# EAGLE design 454_stereo_mic_Rev020000 (EAGLE 9.6.2)
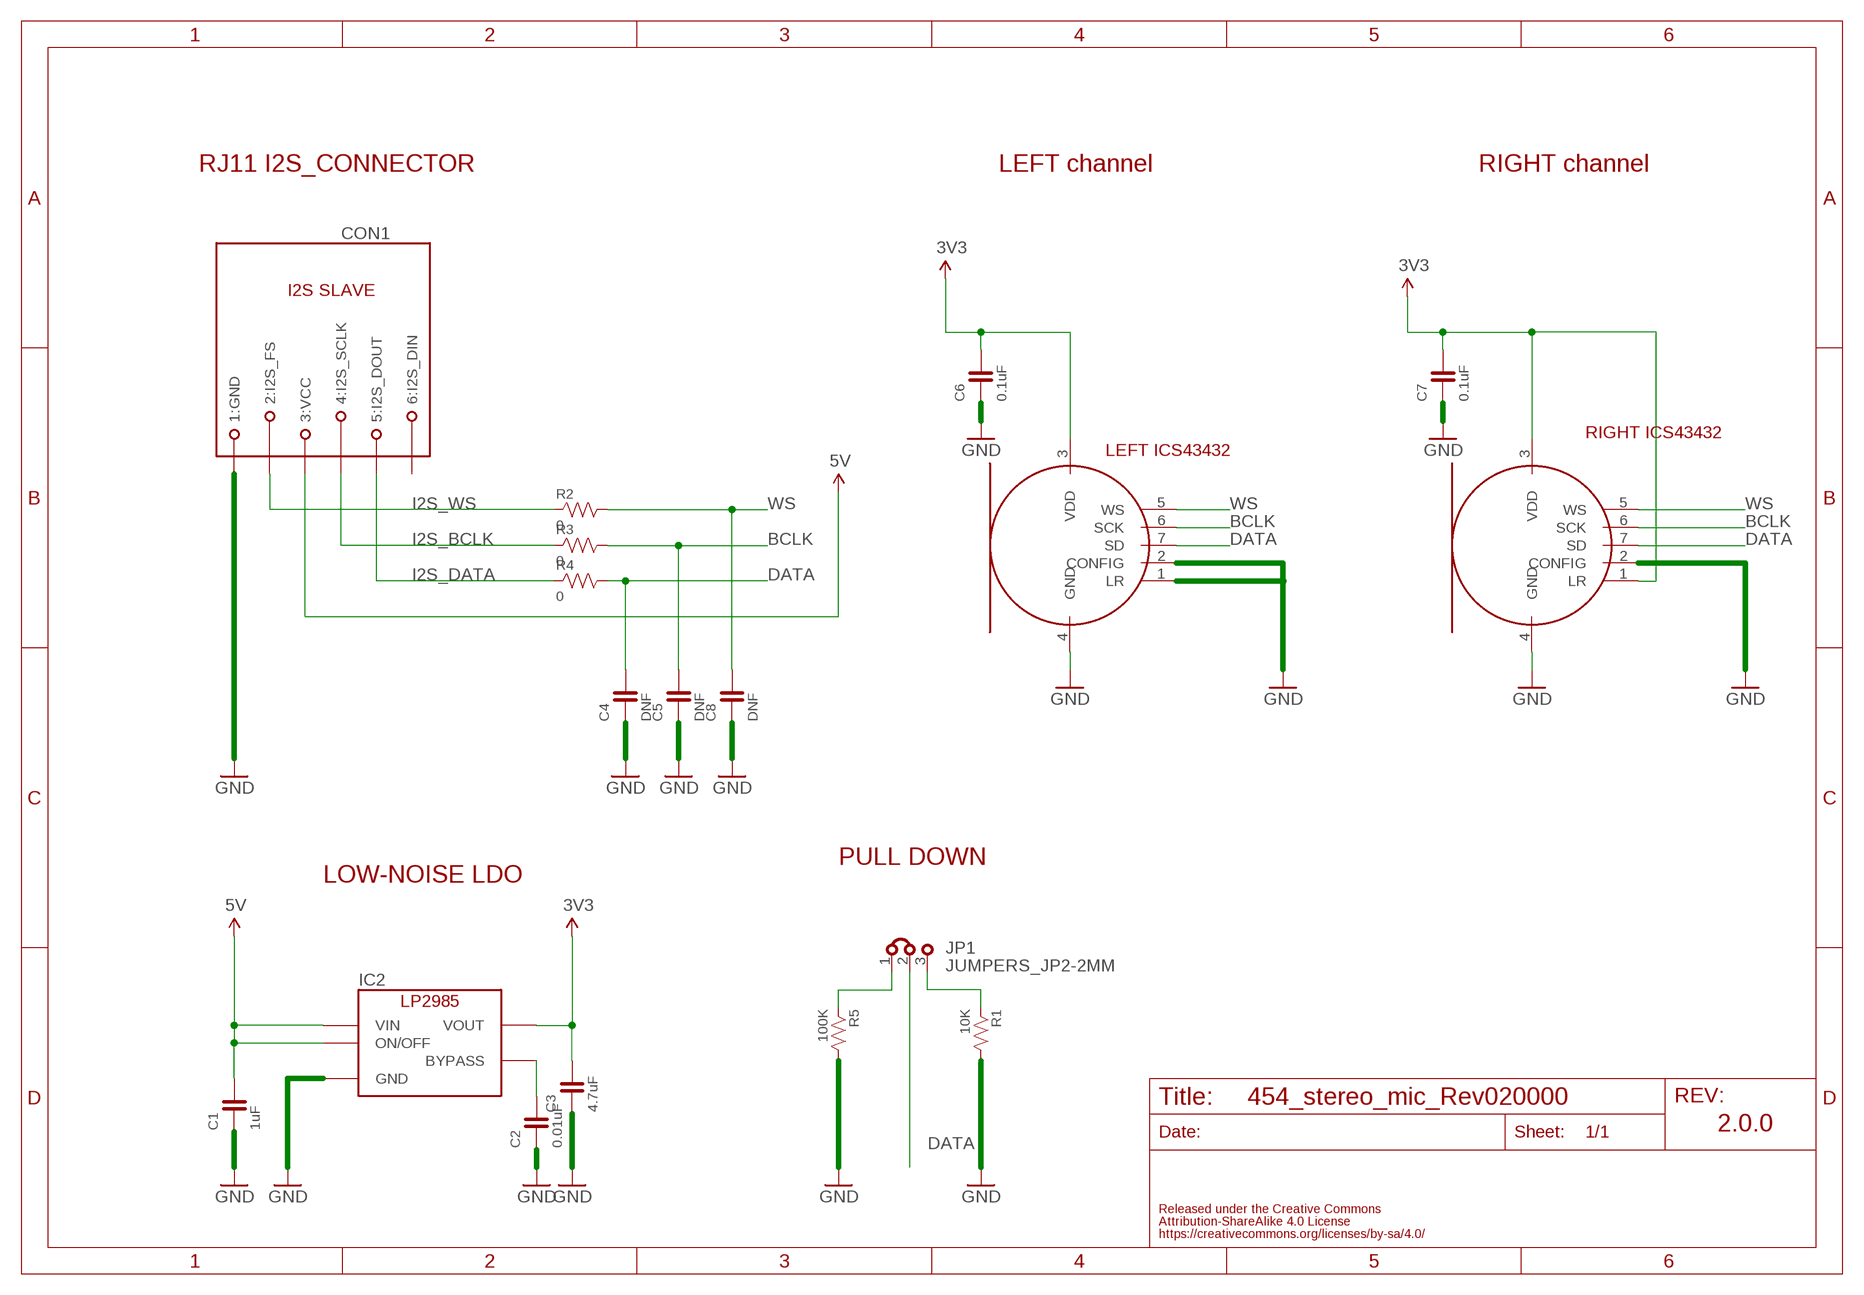
[diagram p0: schematic, sheet 1]

## Parts
C1  1uF  CAPACITOR-0603  [0603]
C2  0.01uF  CAPACITOR-0603  [0603]
C3  4.7uF  CAPACITOR-0603  [0603]
C4  DNF  CAPACITOR-0603  [0603]
C5  DNF  CAPACITOR-0603  [0603]
C6  0.1uF  CAPACITOR-0603  [0603]
C7  0.1uF  CAPACITOR-0603  [0603]
C8  DNF  CAPACITOR-0603  [0603]
CON1  MODULAR-JACK-6P-RJ11_I2S_SLAVE  [7002-6PXC-X]
IC2  LP2985-33DBV  [SOT-23-5]
JP1  JUMPERS_JP2-2MM  [JUMPERS_JP2-2MM]
MIC_LEFT  TDK-ICS43432  [TDK-ICS43432]
MIC_RIGHT  TDK-ICS43432  [TDK-ICS43432]
R1  10K  RESISTOR-0603  [0603]
R2  0  RESISTOR-0603  [0603]
R3  0  RESISTOR-0603  [0603]
R4  0  RESISTOR-0603  [0603]
R5  100K  RESISTOR-0603  [0603]

## Nets
3V3: C3.2 C6.2 C7.2 IC2.5(VOUT) MIC_LEFT.3(VDD) MIC_RIGHT.1(LR) MIC_RIGHT.3(VDD)
5V: C1.2 CON1.3(3:VCC) IC2.1(VIN) IC2.3(ON/OFF)
BCLK: C5.2 MIC_LEFT.6(SCK) MIC_RIGHT.6(SCK) R3.2
DATA: C4.2 JP1.2 MIC_LEFT.7(SD) MIC_RIGHT.7(SD) R4.2
GND: C1.1 C2.1 C3.1 C4.1 C5.1 C6.1 C7.1 C8.1 CON1.1(1:GND) IC2.2(GND) MIC_LEFT.1(LR) MIC_LEFT.2(CONFIG) MIC_LEFT.4(GND) MIC_RIGHT.2(CONFIG) MIC_RIGHT.4(GND) R1.2 R5.2
I2S_BCLK: CON1.4(4:I2S_SCLK) R3.1
I2S_DATA: CON1.5(5:I2S_DOUT) R4.1
I2S_WS: CON1.2(2:I2S_FS) R2.1
N$1: C2.2 IC2.4(BYPASS)
N$2: JP1.1 R5.1
N$3: JP1.3 R1.1
WS: C8.2 MIC_LEFT.5(WS) MIC_RIGHT.5(WS) R2.2
Unconnected: CON1.6(6:I2S_DIN)

## Notes on the sheet
- RJ11 I2S_CONNECTOR | LEFT channel | RIGHT channel
- RIGHT ICS43432
- LEFT ICS43432
- PULL DOWN
- LOW-NOISE LDO
- 2.0.0

## Library data of the parts
C1-C8 = FaBo-Capacitor:CAPACITOR: CAPACITOR
CON1 = FaBo-Connetor:MODULAR-JACK-6P-RJ11_I2S_SLAVE
IC2 = FaBo-Supply:LP2985: LP2985
JP1 = 52101-101-REV-A_v16:JUMPERS_JP2-: Jumper/Bridge
MIC_LEFT MIC_RIGHT = FaBo-Mems:TDK-ICS43432
R1-R5 = FaBo-Resistors:RESISTOR: RESISTOR

## Board
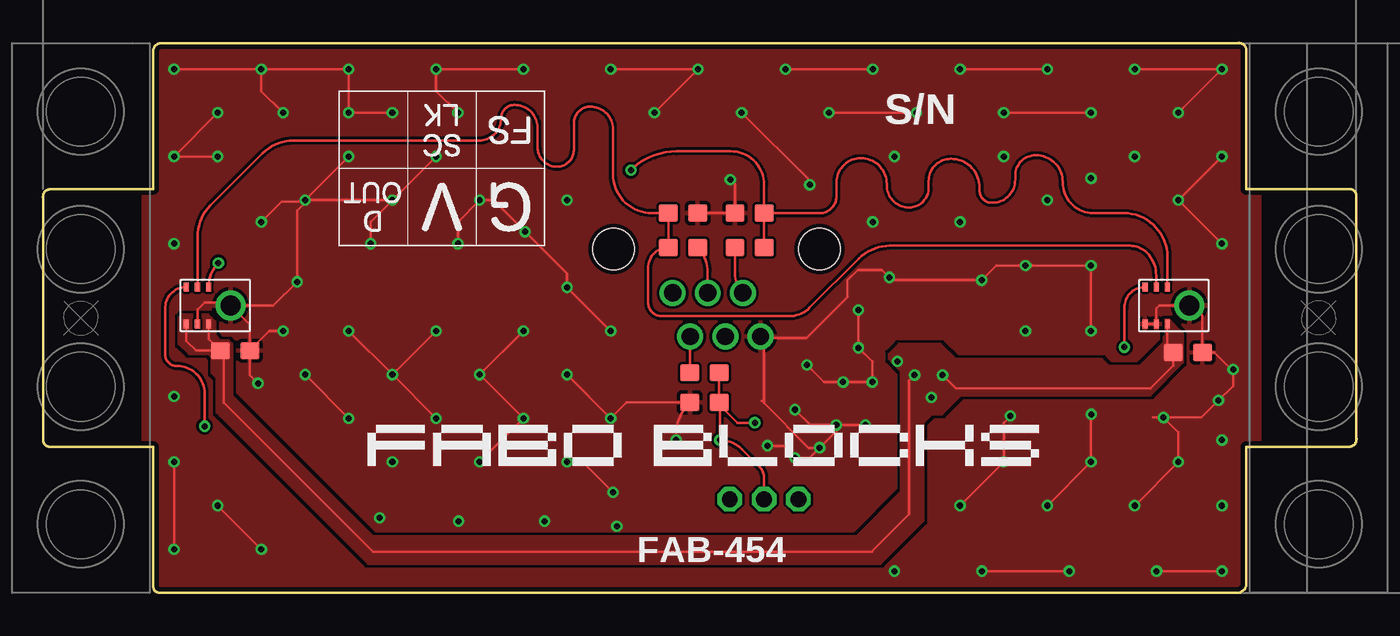
[diagram p1: board, top side]
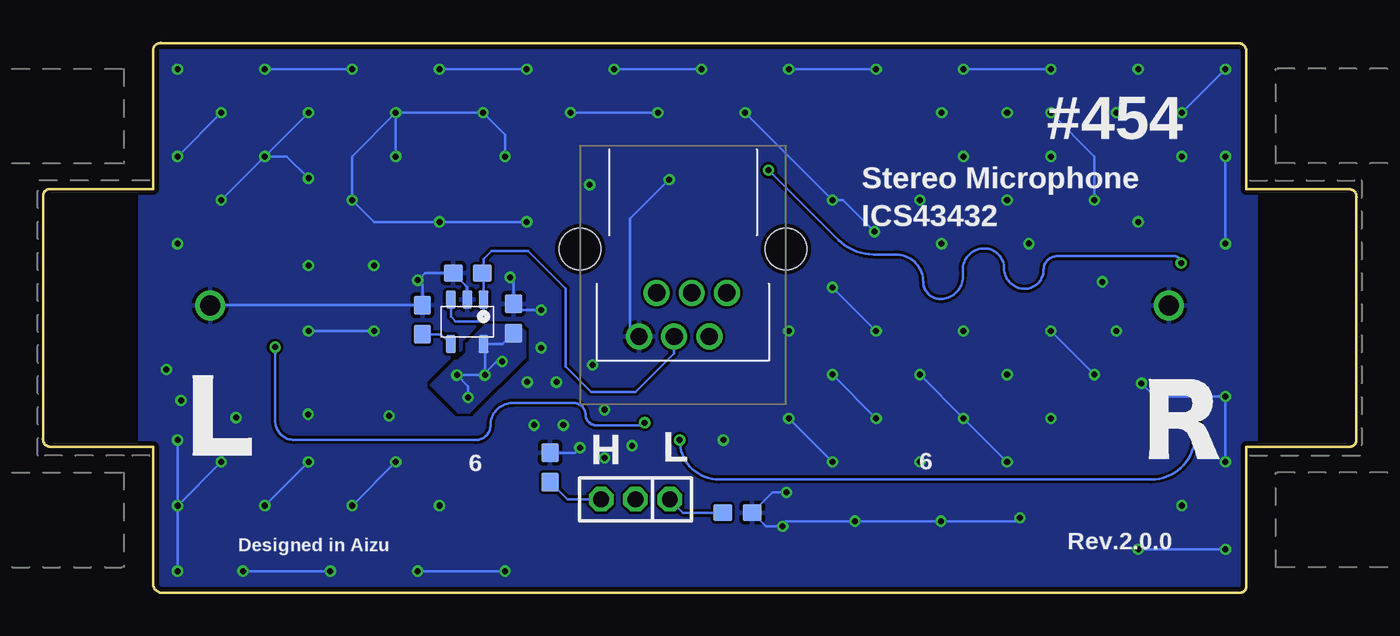
[diagram p2: board, bottom side, seen from below]

Size 76.41 x 32 mm. Coordinates in mm from the lower left corner, seen from the top.
Outline: 6.9,32 69.5,32 arc-90 70,31.6 70,23.5 76,23.5 arc-90 76.4,23.1 76.4,9 arc-90 76,8.5 70,8.5 70,0.5 arc-90 69.4,0 6.8,0 arc-90 6.4,0.4 6.4,8.5 0.4,8.5 arc-90 0,8.9 0,23 arc-90 0.4,23.5 6.4,23.5 6.4,31.5 arc-90 6.9,32
Copper layers (1*16): Top 0.035mm / dielectric 1.6mm / Bottom 0.035mm
Design rules "PCBway": minimum track width 6mil, minimum drill 12mil, track to track 6mil, track to pad 6mil, pad to pad 6mil, via to via 6mil, smd to smd 6mil, copper to edge 10mil, drill to drill 10mil, minimum pad ring 10mil, minimum via ring 6mil, stop-mask expansion 2mil, vias tented up to drill 100mil, thermal gap 8mil
tRestrict: area -2.9,6.1 to 5.7,25.8; area 70.9,6.9 to 79.5,26.6
bRestrict: area 70.9,6.5 to 79.5,26.2; area -2.9,5.7 to 5.7,25.4

### Footprints (pad centres in the part's own frame; a part is rotated, then mirrored left to right if it is on the bottom)
0603 = smd 1.1 x 1: 1 -0.85,0; 2 0.85,0
7002-6PXC-X = drill 1: 1 2.55,5.08; 2 1.53,2.54; 3 0.51,5.08; 4 -0.51,2.54; 5 -1.53,5.08; 6 -2.55,2.54 | hole 2.4: -6,0; 6,0
SOT-23-5 = smd 0.6 x 1.05: 1 -0.95,-1.3; 2 0,-1.3; 3 0.95,-1.3; 4 0.95,1.3; 5 -0.95,1.3
JUMPERS_JP2-2MM = drill 0.914 octagon: 1 -2,0; 2 0,0; 3 2,0
TDK-ICS43432 = smd 0.5 x 0.3: 1 1.075,-2.575; 2 1.075,-1.925; 3 1.075,-1.275; 5 -1.075,-1.275; 6 -1.075,-1.925; 7 -1.075,-2.575 | drill 1.15 pad 1.65: 4 0,0

### Placement (x,y rotation side)
C1  51.69,18.62 0 bottom
C2  54.34,15.89 270 bottom
C3  49.04,15.97 270 bottom
C4  38.48,11.09 0 top
C5  37.23,22.1 180 top
C6  11.18,14.1 180 top
C7  66.59,14 180 top
C8  41.1,22.1 0 top
CON1  39.18,20 180 bottom
IC2  51.73,15.78 180 bottom
JP1  41.94,5.45 180 bottom
MIC_LEFT  66.68,16.73 270 top
MIC_RIGHT  10.91,16.73 270 top
R1  46.92,7.31 90 bottom
R2  41.1,20.1 0 top
R3  37.23,20.1 180 top
R4  38.48,12.81 0 top
R5  36.01,4.67 0 bottom
U$2  [4-1BLOCK]  2.2,16 0 top
U$3  [4-1BLOCK]  74.2,16 180 top

### Tracks (layer width: path | path; a pad name or v marks a point on that pad's centre or on a via)
3V3  (via drill 0.35)
  Top 0.152: MIC_LEFT.3 65.4,14.33 arc90 C7.2 65.74,13.24 64.4,11.9 53.1,11.9 v52.33,12.68 | 48.2,2.4 19.21,2.4 10.52,11.09 10.52,13.91 C6.2 | 48.2,2.4 48.23,2.4 | C6.2 9.64,14.79 MIC_RIGHT.3 | C6.2 8.9,14.1 8.34,14.67 MIC_RIGHT.1 | 48.2,2.4 50.38,4.58 50.38,12.35 v50.7,12.68
  Bottom 0.152: 50.7,12.8 v50.7,12.68 v52.33,12.68 51.68,12.03 v51.68,11.38 | 50.7,12.8 50.7,14.41 IC2.5 49.67,14.48 C3.2 | v49.7,13.48 50.03,13.48 50.7,12.8
  pour Bottom (no thermals): 51.58,10.5 48.38,13.7 48.38,15.2 48.78,15.6 50.68,15.6 51.78,14.5 51.78,14 52.28,13.5 52.48,13.5 53.87,12.11 52.26,10.5
  pour Top (no thermals): 7.9,14.5 7.9,16 8.1,16.2 9.6,16.2 9.8,16 10,15.8 10,15 10.2,14.8 10.3,14.7 10.8,14.7 11,14.5 11,13.9 11,11.5 19.2,3.3 47.3,3.3 49.9,5.9 49.9,11.9 49.9,12.9 49.2,13.6 49.2,13.9 49.8,14.5 52.2,14.5 53.1,13.6 61.6,13.6 62,13.2 63.8,13.2 63.9,13.3 65.2,14.6 65.2,14.9 65.3,15 65.3,15.9 65.5,15.9 66.3,15.1 66.3,13.4 64.4,11.5 53.4,11.5 52.3,10.4 51.7,10.4 51.2,9.9 51.2,4.2 48.7,1.7 45,1.7 18.9,1.7 10.3,10.3 10.1,10.5 10.1,12.5 9.8,12.8 9.8,13.7 9.6,13.9 8.7,13.9 8.5,13.9
5V
  Bottom 0.152: CON1.3 39.69,13.94 41.93,11.7 44.53,11.7 46,13.18 46,17.7 48.2,19.9 50.3,19.9 50.78,19.43 50.78,18.56 | IC2.3 52.68,16.08 52.4,15.8 51,15.8 50.78,16.03 IC2.1 50.78,18.56 | 50.78,18.56 C1.2
BCLK
  Top 0.152: C5.2 36.4,22.13 36.4,22.43 36.38,22.4 C5.2 | C5.2 R3.2 arc90 35.2,18.93 35.2,16.9 arc90 36,16.1 43.4,16.1 arc45 44.6,16.6 47.46,19.46 arc-45 49.25,20.2 63.24,20.2 arc-45 64.2,19.8 arc-45 64.75,18.47 MIC_LEFT.6 | C5.2 35.43,22.1 arc-90 33.15,24.38 33.15,27 arc90 31.85,28.3 arc90 30.88,27.33 30.88,25.78 arc-90 29.9,24.8 arc-90 28.76,25.94 28.76,27.06 arc90 27.43,28.4 arc90 26.65,27.63 arc-90 25.35,26.33 14.58,26.33 arc45 12.78,25.58 9.73,22.53 arc45 8.99,20.74 MIC_RIGHT.6
DATA  (via drill 0.35)
  Top 0.152: v62.9,14.3 62.9,16.6 arc-90 MIC_LEFT.7 | MIC_RIGHT.7 arc90 7.1,16.57 7.1,13.9 arc90 7.8,13.2 arc-90 9.4,11.6 v9.4,9.7 | 39.37,10.92 v39.37,8.89 arc-45 40.67,8.35 41.66,7.37 arc-45 41.94,6.68 JP1.2 | 39.37,10.92 39.37,11.05 C4.2 R4.2 | v41.4,9.91 40.39,9.91 39.37,10.92
  Bottom 0.152: v62.9,14.3 62.9,10.01 arc-90 61.79,8.9 51.23,8.9 arc-90 50.38,9.75 arc90 49.08,11.05 45.5,11.05 arc90 44.85,10.4 arc-90 44.2,9.75 41.56,9.75 arc-90 v41.4,9.91 | v9.4,9.7 9.4,9.14 arc90 11.94,6.6 37.08,6.6 arc90 v39.37,8.89
GND  (via drill 0.35)
  Top 0.152: C5.1 C8.1 40.25,23.78 v39.98,24.05 | 41.93,11.05 41.93,14.72 41.81,14.84 | 41.81,14.84 CON1.1 | 41.81,14.84 44.41,14.84 46.8,17.23 46.8,18.2 47.4,18.8 48.8,18.8 v49.24,18.37 49.4,18.2 v54.6,18.2 55.45,19.05 v57.15,19.05 v60.96,19.05 v60.96,15.24 | v45.18,8.45 44.53,8.45 41.93,11.05 | v20.32,12.7 v22.86,10.16 | v30.48,12.7 v33.02,10.16 33.95,11.09 C4.1 37.58,11.03 arc45 36.83,9.24 v36.83,8.89 | v33.02,15.24 v30.48,17.78 30.48,18.58 v28.04,21.02 26.2,22.86 v25.4,22.86 24.13,21.59 v24.13,20.32 | v20.32,22.86 15.4,22.86 | 15.4,22.86 v15.24,22.86 v17.78,25.4 | v56.28,10.3 55.88,9.91 v55.88,7.62 v53.34,5.08 | v58.42,5.08 v60.96,7.62 60.96,10.39 v60.98,10.4 | v63.5,5.08 v66.04,7.62 66.04,9.34 v65.18,10.2 | v54.61,1.27 v59.69,1.27 | v64.77,1.27 v68.58,1.27 | 64.55,10.2 v65.18,10.2 | v65.18,10.2 67.38,10.2 v68.38,11.2 69.23,12.05 69.23,12.9 | 69.23,12.9 v69.23,13 | 41.81,11.16 41.93,11.05 | v42.14,8.56 43.04,8.56 v43.74,7.86 44.59,7.86 v45.18,8.45 | v45.18,8.45 46.14,9.41 v46.14,9.76 | v46.14,9.76 v47.84,9.76 | v46.14,9.76 44.64,9.76 v43.74,10.66 | v44.44,13.26 45.44,12.26 v46.54,12.26 v48.24,12.26 48.24,13.47 v47.44,14.26 v47.44,16.46 | MIC_LEFT.1 MIC_LEFT.2 64.75,16.55 64.93,16.73 MIC_LEFT.4 arc-90 67.44,15.97 C7.1 68.13,14 69.23,12.9 | MIC_RIGHT.2 8.99,16.49 9.4,16.9 10.74,16.9 MIC_RIGHT.4 | MIC_RIGHT.4 12.03,15.61 C6.1 | MIC_RIGHT.4 13.4,16.73 v14.78,18.1 14.78,22.24 15.32,22.78 | v12.5,12.2 12.03,12.68 C6.1 | 15.32,22.78 15.4,22.86 | v20.32,12.7 v22.86,15.24 | v27.94,15.24 v25.4,12.7 v27.94,10.16 v25.4,7.62 | v20.32,12.7 v17.78,15.24 | v15.24,12.7 v17.78,10.16 | v66.04,27.94 v68.58,30.48 v63.5,30.48
  Top 0.152: v68.58,25.4 v66.04,22.86 v68.58,20.32 | v60.96,27.94 v55.88,27.94 | v50.8,27.94 v45.72,27.94 | v40.64,27.94 44.6,23.98 v44.6,23.75 | v58.42,30.48 v53.34,30.48 | v48.26,30.48 v43.18,30.48 | v35.56,27.94 v38.1,30.48 v33.02,30.48 | v27.94,30.48 v22.86,30.48 22.86,29.21 v24.13,27.94 | v12.7,30.48 v17.78,30.48 v17.78,27.94 v20.32,27.94 | v12.7,30.48 v7.62,30.48 | v10.16,27.94 v7.62,25.4 v10.16,25.4 | v7.62,7.62 v7.62,2.54 | v12.7,2.54 v10.16,5.08 | v20.32,22.86 v22.86,25.4 | v12.7,21.59 13.89,22.78 15.32,22.78 | v19.05,20.32 19.05,21.59 v20.32,22.86 | v13.97,27.94 12.7,29.21 v12.7,30.48 | C6.1 13.17,15.24 v13.97,15.24 | v33.15,5.85 31.38,7.62 v30.48,7.62
  Bottom 0.152: v39.98,24.05 42.25,21.78 42.25,15.45 CON1.1 | v49.24,18.37 49.04,18.16 C3.1 48.68,16.46 v47.44,16.46 | v33.15,5.85 33.98,5.85 R5.2 34.36,3.88 v33.38,3.88 arc90 33.08,4.18 v29.18,4.18 v24.18,4.18 19.78,4.18 v19.58,4.38 | R1.2 45.47,8.16 v45.18,8.45 | IC2.2 51.73,17.81 C1.1 54.18,18.62 v54.6,18.2 54.34,17.94 C2.1 MIC_LEFT.4 | v25.4,12.7 v22.86,10.16 v20.32,7.62 | v27.94,10.16 v30.48,12.7 | v27.94,15.24 v30.48,17.78 | v28.04,21.02 29.88,22.86 v30.48,22.86 v35.56,27.94 | v15.24,22.86 15.24,25.4 v17.78,27.94 | v55.88,7.62 v58.42,5.08 | v60.96,7.62 v63.5,5.08 | v66.04,7.62 v68.58,5.08 | v49.53,1.27 v54.61,1.27 | v59.69,1.27 v64.77,1.27 | v68.58,1.27 v68.58,5.08 | v68.58,5.08 v68.58,8.89 | 33.14,10.28 v33.02,10.16 v30.48,7.62 | v12.5,12.2 11.73,11.43 v7.62,11.43 v7.62,7.62 | v17.78,15.24 v15.24,12.7 | v66.04,27.94 v68.58,25.4 | v66.04,22.86 v63.5,25.4 | v63.5,25.4 v60.96,27.94 | v55.88,27.94 v50.8,27.94 49.53,26.67 v49.53,25.4 | v45.72,27.94 v40.64,27.94 | v63.5,30.48 v58.42,30.48 | v53.34,30.48 v48.26,30.48 | v43.18,30.48 v38.1,30.48 | v33.02,30.48 v27.94,30.48 | v22.86,30.48 v17.78,30.48 | v7.62,30.48 v10.16,27.94 | v7.62,25.4 v7.62,20.32 | v7.62,2.54 v12.7,2.54 | v55.88,27.94 58.42,25.4 v58.42,22.86 57.15,21.59 v53.34,21.59 v48.26,21.59 | v60.96,24.13 62.23,25.4 v63.5,25.4 | v55.88,25.4 v55.88,27.94 | v57.15,15.24 v60.96,15.24
  pour Top (rank 6): -3.57,-1.95 78.18,-1.95 78.18,36.63 -3.57,36.63
  pour Bottom (rank 6): -5.12,-3.25 79.81,-3.25 79.81,35.33 -5.12,35.33
I2S_BCLK
  Top 0.152: CON1.4 38.67,18.68 arc45 R3.1
I2S_DATA
  Top 0.152: R4.1 37.63,14.91 CON1.5
I2S_WS
  Top 0.152: CON1.2 arc-45 40.25,18.56 R2.1
N$1
  Bottom 0.152: IC2.4 53.24,15.04 C2.2
N$2
  Bottom 0.152: JP1.1 39.17,4.67 R5.1
N$3
  Bottom 0.152: JP1.3 45.9,5.45 R1.1
WS  (via drill 0.35)
  Top 0.152: R2.2 C8.2 | C8.2 45.18,22.1 arc90 46.15,23.08 46.15,23.88 arc-90 47.58,25.3 arc-90 49.08,23.8 49.08,23.73 arc90 50.38,22.43 arc90 51.52,23.56 51.52,23.96 arc-90 52.81,25.26 arc-90 54.48,23.6 54.48,23.43 arc90 55.2,22.7 arc90 56.55,24.05 56.55,24.28 arc-90 57.75,25.48 arc-90 59.31,23.92 59.31,23.89 arc90 61.1,22.1 62.86,22.1 arc-90 65.4,19.56 MIC_LEFT.5 | C8.2 41.95,23.75 arc90 40,25.7 36.85,25.7 arc45 v34.21,24.61 v34.2,24.6 | MIC_RIGHT.5 9.64,17.84 arc-45 v10.2,19.2
  Bottom 0.152: v34.2,24.6 30.15,20.55 arc-45 28.1,19.7 26.8,19.7 arc90 25.2,18.1 arc-90 24.2,17.1 arc-90 22.9,18.4 22.9,18.8 arc90 21.65,20.05 arc90 20.5,18.9 arc-90 19.3,17.7 arc-90 18.2,18.8 arc90 17.4,19.6 10.6,19.6 arc90 v10.2,19.2

### Text on the board
tPlace: S/N | FAB-454
bPlace: #454 | Stereo Microphone | ICS43432 | 6 | L | 6 | H | Rev.2.0.0 | Designed in Aizu
Document: #454 Stereo Microphone / Rev2.0.0 / 2023/04/05